# EAGLE design MS20v2 (EAGLE 9.6.2)
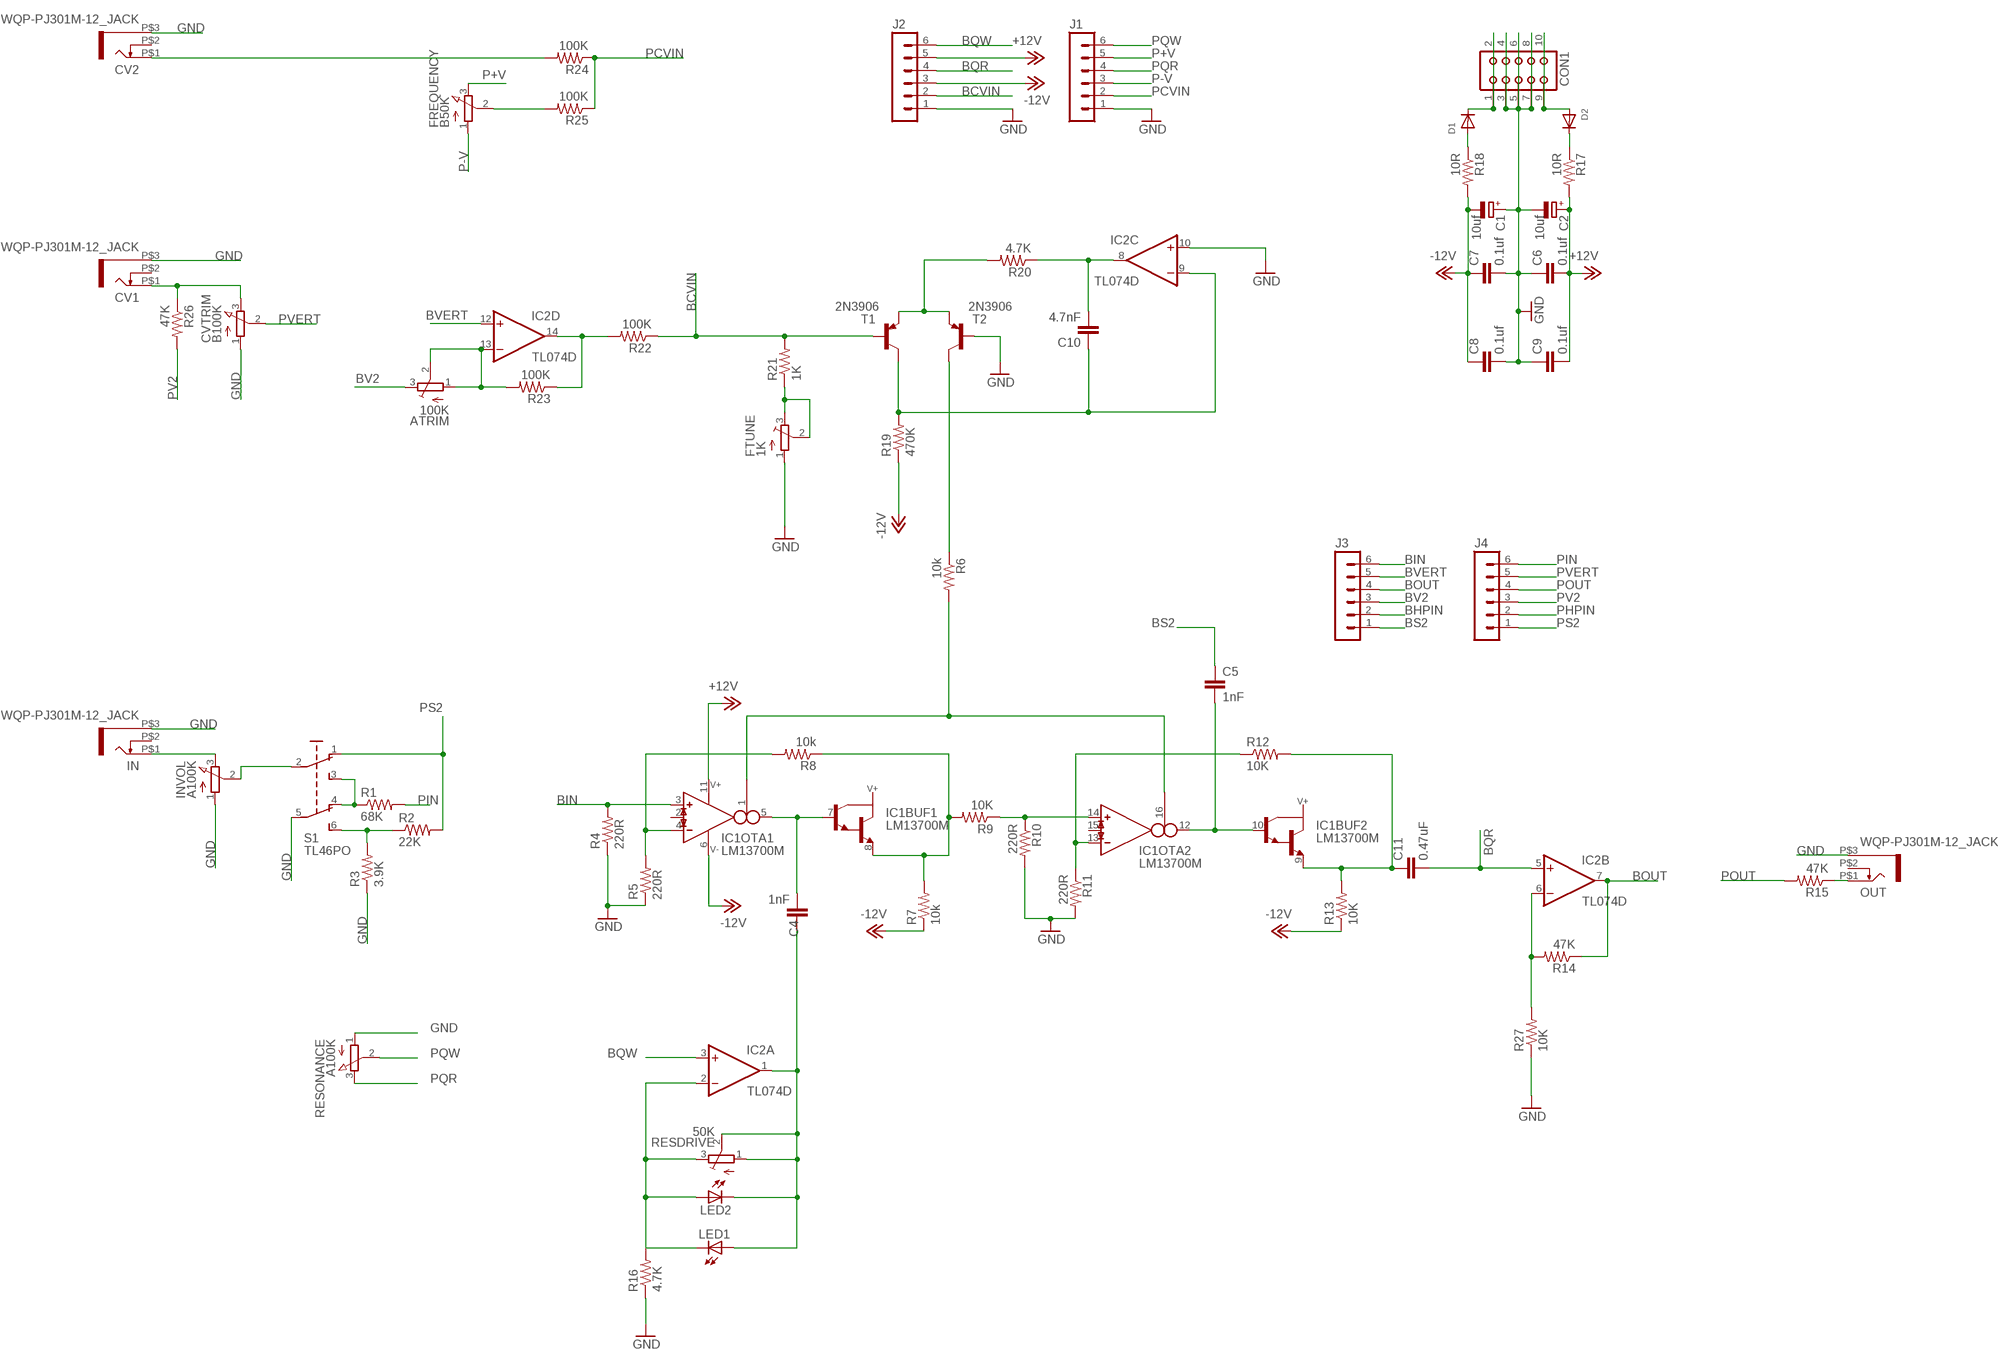
[diagram p0: schematic, sheet 1]

## Parts
ATRIM  100K  TRIMPOTTC33X  [TC33X]
C1  10uf  CPOL-EU153CLV-0405  [153CLV-0405]
C2  10uf  CPOL-EU153CLV-0405  [153CLV-0405]
C4  1nF  C-EUC0603  [C0603]
C5  1nF  C-EUC0603  [C0603]
C6  0.1uf  C-EUC0603  [C0603]
C7  0.1uf  C-EUC0603  [C0603]
C8  0.1uf  C-EUC0603  [C0603]
C9  0.1uf  C-EUC0603  [C0603]
C10  4.7nF  C-EUC0603  [C0603]
C11  0.47uF  C-EUC0603  [C0603]
CON1  CON10  [CON10]
CV1  WQP-PJ301M-12_JACK  [WQP-PJ301M-12_JACK]
CV2  WQP-PJ301M-12_JACK  [WQP-PJ301M-12_JACK]
CVTRIM  B100K  EVUF2A  [EVUF]
D1  DIODESOD-123  [SOD-123]
D2  DIODESOD-123  [SOD-123]
FREQUENCY  B50K  EVUF2A  [EVUF]
FTUNE  1K  TRIMPOTTC33X  [TC33X]
IC1  LM13700M  [SO16]
IC2  TL074D  [SO14]
IN  WQP-PJ301M-12_JACK  [WQP-PJ301M-12_JACK]
INVOL  A100K  EVUF2A  [EVUF]
J1  MA06-1  [MA06-1]
J2  MA06-1  [MA06-1]
J3  MA06-1  [MA06-1]
J4  MA06-1  [MA06-1]
LED1  LED3MM  [LED3MM]
LED2  LED3MM  [LED3MM]
OUT  WQP-PJ301M-12_JACK  [WQP-PJ301M-12_JACK]
R1  68K  R-US_R0603  [R0603]
R2  22K  R-US_R0603  [R0603]
R3  3.9K  R-US_R0603  [R0603]
R4  220R  R-US_R0603  [R0603]
R5  220R  R-US_R0603  [R0603]
R6  10k  R-US_R0603  [R0603]
R7  10k  R-US_R0603  [R0603]
R8  10k  R-US_R0603  [R0603]
R9  10K  R-US_R0603  [R0603]
R10  220R  R-US_R0603  [R0603]
R11  220R  R-US_R0603  [R0603]
R12  10K  R-US_R0603  [R0603]
R13  10K  R-US_R0603  [R0603]
R14  47K  R-US_R0603  [R0603]
R15  47K  R-US_R0603  [R0603]
R16  4.7K  R-US_R0603  [R0603]
R17  10R  R-US_R0603  [R0603]
R18  10R  R-US_R0603  [R0603]
R19  470K  R-US_R0603  [R0603]
R20  4.7K  R-US_R0603  [R0603]
R21  1K  R-US_R0603  [R0603]
R22  100K  R-US_R0603  [R0603]
R23  100K  R-US_R0603  [R0603]
R24  100K  R-US_R0603  [R0603]
R25  100K  R-US_R0603  [R0603]
R26  47K  R-US_R0603  [R0603]
R27  10K  R-US_R0603  [R0603]
RESDRIVE  50K  TRIMPOTTC33X  [TC33X]
RESONANCE  A100K  EVUF2A  [EVUF]
S1  TL46PO  [TL4XPO]
T1  2N3906  MMBT3906LT1-PNP-SOT23-BEC  [SOT23-BEC]
T2  2N3906  MMBT3906LT1-PNP-SOT23-BEC  [SOT23-BEC]

## Nets
+12V: C2.+ C6.2 C9.2 IC1.11(SUPPLY:V+) J2.5 R17.2
-12V: C1.- C7.1 C8.1 IC1.6(SUPPLY:V-) J2.3 R7.1 R13.1 R18.2 R19.1
BCVIN: J2.2 R21.2 R22.1 T1.B
BHPIN: J3.2
BIN: IC1.3(OTA1:IN_P) J3.6 R4.2
BOUT: IC2.7(B:OUT) J3.4 R14.1
BQR: C11.2 IC2.5(B:+IN) J2.4
BQW: IC2.3(A:+IN) J2.6
BS2: C5.1 J3.1
BV2: ATRIM.3(E) J3.3
BVERT: IC2.12(D:+IN) J3.5
GND: C1.+ C2.- C6.1 C7.2 C8.2 C9.1 CON1.3 CON1.4 CON1.5 CON1.6 CON1.7 CON1.8 CV1.P$3 CV2.P$3 CVTRIM.1(A) FTUNE.1(A) IC2.10(C:+IN) IN.P$3 INVOL.1(A) J1.1 J2.1 OUT.P$3 R3.1 R4.1 R5.1 R10.2 R11.2 R16.1 R27.1 RESONANCE.1(A) S1.5(P1) T2.B
N$1: CON1.9 CON1.10 D2.A
N$2: CON1.1 CON1.2 D1.C
N$3: R1.1 S1.3(S) S1.4(O1)
N$4: R2.1 R3.2 S1.6(S1)
N$5: D1.A R18.1
N$6: IC1.4(OTA1:IN_N) R5.2 R8.2
N$7: CV1.P$1 CVTRIM.3(E) R26.1
N$8: D2.C R17.1
N$9: IC1.13(OTA2:IN_N) R11.1 R12.1
N$10: IC1.8(BUF1:E) R7.2 R8.1 R9.2
N$11: C4.2 IC1.5(OTA1:OUT) IC1.7(BUF1:B)
N$12: IC1.1(OTA1:I_BIAS) IC1.16(OTA2:I_BIAS) R6.2
N$13: IC2.14(D:OUT) R22.2 R23.1
N$14: C4.1 IC2.1(A:OUT) LED1.A LED2.K(C) RESDRIVE.1(A) RESDRIVE.2(S)
N$15: IC1.14(OTA2:IN_P) R9.1 R10.1
N$16: C11.1 IC1.9(BUF2:E) R12.2 R13.2
N$17: C5.2 IC1.10(BUF2:B) IC1.12(OTA2:OUT)
N$18: IC2.6(B:-IN) R14.2 R27.2
N$19: R6.1 T2.C
N$20: R20.2 T1.E T2.E
N$21: C10.2 IC2.8(C:OUT) R20.1
N$22: C10.1 IC2.9(C:-IN) R19.2 T1.C
N$23: IC2.2(A:-IN) LED1.K(C) LED2.A R16.2 RESDRIVE.3(E)
N$26: FTUNE.2(S) FTUNE.3(E) R21.1
N$28: ATRIM.1(A) ATRIM.2(S) IC2.13(D:-IN) R23.2
N$29: CV2.P$1 R24.2
N$30: INVOL.2(S) S1.2(P)
N$31: IN.P$1 INVOL.3(E)
N$40: FREQUENCY.2(S) R25.2
N$45: OUT.P$1 R15.1
P+V: FREQUENCY.3(E) J1.5
P-V: FREQUENCY.1(A) J1.3
PCVIN: J1.2 R24.1 R25.1
PHPIN: J4.2
PIN: J4.6 R1.2
POUT: J4.4 R15.2
PQR: J1.4 RESONANCE.3(E)
PQW: J1.6 RESONANCE.2(S)
PS2: J4.1 R2.2 S1.1(O)
PV2: J4.3 R26.2
PVERT: CVTRIM.2(S) J4.5
Unconnected: CV1.P$2 CV2.P$2 IC1.2(OTA1:I_DIODE) IC1.15(OTA2:I_DIODE) IN.P$2 OUT.P$2

## Power pins joined to a net without a drawn wire
+12V: IC2.4(P:V+)
-12V: IC2.11(P:V-)

## Library data of the parts
ATRIM FTUNE RESDRIVE = adafruit:TRIMPOT: SMT trimmer potentiometer part number TC33X http://www.ladyada.net/library/eagle
C1 C2 = rcl:CPOL-EU: POLARIZED CAPACITOR, European symbol; SPICEPREFIX: C
C4-C11 = rcl:C-EU: CAPACITOR, European symbol; SPICEPREFIX: C
CON1 = con-harting:CON10: CONNECTOR; OC_FARNELL: unknown; OC_NEWARK: unknown
CV1 CV2 IN OUT = thonkiconn:WQP-PJ301M-12_JACK
CVTRIM FREQUENCY INVOL RESONANCE = pot:EVU: 9 mm Square Rotary Potentiometers Source: Panasonic
D1 D2 = adafruit:DIODE: Diode SMADIODE - SMA Surface Mount Package 20V 1A Schottky Diode Digikey: 641-1014-6-ND DO-1N4148 - Through Hole Small Current Diode SOD-123 20V 1 A (.5mV Vf) Schottky Diode - Digikey: MBRX120TPMSCT-ND SOD-323 10V 570mA (.38mV Vf, 3ns) Schottky Diode - Digikey: ZLLS410CT-ND SOD-523 30V 30mA Schottky Diode (RB751S-40TE61) - Digikey: RB751S-40TE61CT-ND SOT23-R/W - SOT23 Package (R = Solder Paste/Reflow Ovens, W = Hand-Soldering) BAT54Film 40V 300mA - Digikey: 497-7162-1-ND
IC1 = ota:LM13700: Dual OTA with buffers
IC2 = linear:TL074: OP AMP
J1-J4 = con-lstb:MA06-1: PIN HEADER; OC_FARNELL: unknown; OC_NEWARK: unknown
LED1 LED2 = adafruit:LED: LED OSRAM: - CHIPLED LG R971, LG N971, LY N971, LG Q971, LY Q971, LO R971, LY R971 LH N974, LH R974 LS Q976, LO Q976, LY Q976 LO Q996 - Hyper CHIPLED LW Q18S LB Q993, LB Q99A, LB R99A - SideLED LS A670, LO A670, LY A670, LG A670, LP A670 LB A673, LV A673, LT A673, LW A673 LH A674 LY A675 LS A676, LA A676, LO A676, LY A676, LW A676 LS A679, LY A679, LG A679 - Hyper Micro SIDELED® LS Y876, LA Y876, LO Y876, LY Y876 LT Y87S - SmartLED LW L88C, LW L88S LB L89C, LB L89S, LG L890 LS L89K, LO L89K, LY L89K LS L896, LA L896, LO L896, LY L896 - TOPLED LS T670, LO T670, LY T670, LG T670, LP T670 LSG T670, LSP T670, LSY T670, LOP T670, LYG T670 LG T671, LOG T671, LSG T671 LB T673, LV T673, LT T673, LW T673 LH T674 LS T676, LA T676, LO T676, LY T676, LB T676, LH T676, LSB T676, LW T676 LB T67C, LV T67C, LT T67C, LS T67K, LO T67K, LY T67K, LW E67C LS E67B, LA E67B, LO E67B, LY E67B, LB E67C, LV E67C, LT E67C LW T67C LS T679, LY T679, LG T679 LS T770, LO T770, LY T770, LG T770, LP T770 LB T773, LV T773, LT T773, LW T773 LH T774 LS E675, LA E675, LY E675, LS T675 LS T776, LA T776, LO T776, LY T776, LB T776 LHGB T686 LT T68C, LB T68C - Hyper Mini TOPLED® LB M676 - Mini TOPLED Santana® LG M470 LS M47K, LO M47K, LY M47K Source: http://www.osram.convergy.de/
R1-R27 = rcl:R-US_: RESISTOR, American symbol; SPICEPREFIX: R
S1 = switch:TL46PO: TINY SWITCH ON - ON Source: http://www2.produktinfo.conrad.com/datenblaetter/700000-724999/705152-da-01-de-Subminiaturschalter_TL_36YO.pdf
T1 T2 = transistor:*-PNP-: PNP Transistror

## Board
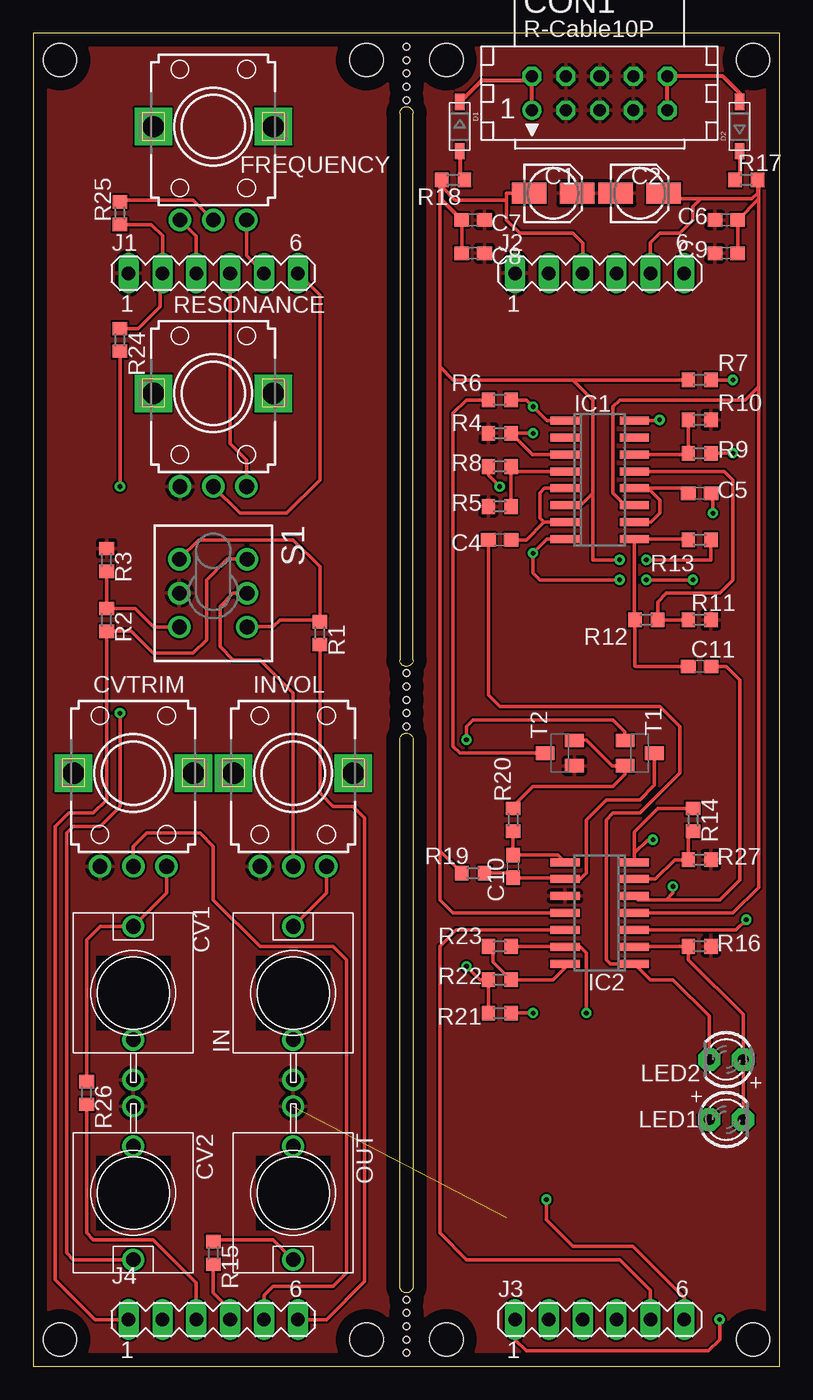
[diagram p1: board, top side]
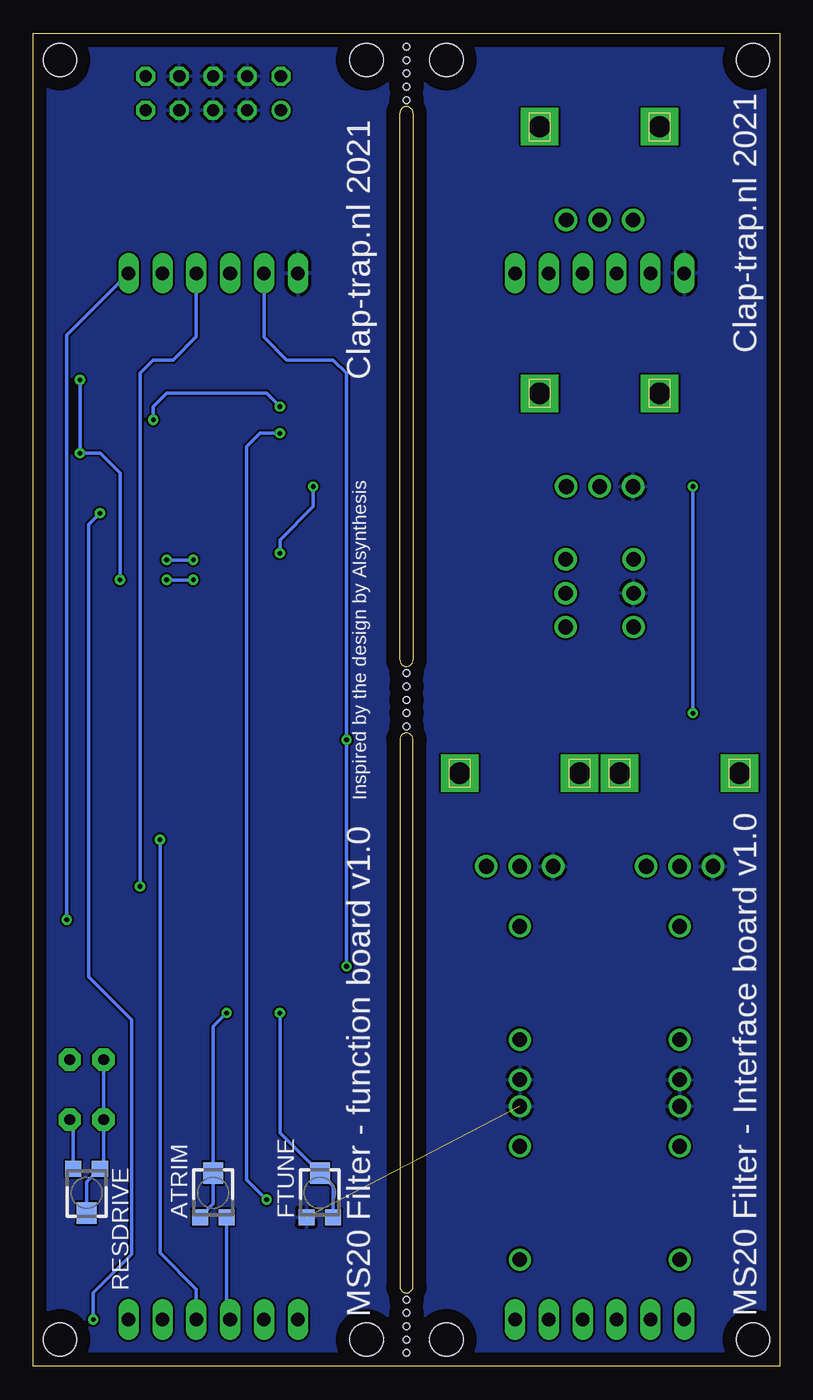
[diagram p2: board, bottom side, seen from below]

Size 56 x 100 mm. Coordinates in mm from the lower left corner, seen from the top.
Outline: 0,0 56,0 56,100 0,100 0,0
Outline: 28.5,53 arc-180 27.5,53 27.5,94 arc-180 28.5,94 28.5,53
Outline: 27.5,47 arc-180 28.5,47 28.5,6 arc-180 27.5,6 27.5,47
Copper layers (1*16): Top 0.035mm / dielectric 1.5mm / Bottom 0.035mm
Design rules "default": minimum track width 6mil, minimum drill 0.35mm, track to track 6mil, track to pad 6mil, pad to pad 6mil, via to via 6mil, smd to smd 6mil, copper to edge 40mil, drill to drill 6mil, minimum pad ring 10mil, minimum via ring 8mil, stop-mask expansion 4mil, vias tented up to drill 0mil, thermal gap 10mil
Holes 2.5 mm at 2,2 25,2 31,2 54,2 2,98 25,98 31,98 54,98
Holes 0.5 mm at 28,4 28,3 28,2 28,1 28,5 28,99 28,98 28,97 28,96 28,95 28,51 28,50 28,49 28,48 28,52

### Footprints (pad centres in the part's own frame; a part is rotated, then mirrored left to right if it is on the bottom)
TC33X = smd 1.2 x 1.2: 1 -1,-1.825; 3 1,-1.825 | smd 1.5 x 1.6: 2 0,1.5
153CLV-0405 = smd 2.6 x 1.6: + 1.8,0; - -1.8,0
C0603 = smd 1.1 x 1: 1 -0.85,0; 2 0.85,0
CON10 = drill 0.914: 1 -5.08,-1.27 | drill 0.914 octagon: 2 -5.08,1.27; 3 -2.54,-1.27; 4 -2.54,1.27; 5 0,-1.27; 6 0,1.27; 7 2.54,-1.27; 8 2.54,1.27; 9 5.08,-1.27; 10 5.08,1.27
WQP-PJ301M-12_JACK = drill 1.1: P$1 0,5; P$2 0,-3.5; P$3 0,-6.5
EVUF = drill 1.1 pad 1.676: 1 -2.5,-7; 2 0,-7; 3 2.5,-7 | drill 1.6 pad 2.8 square: M1 4.5,0; M2 -4.5,0
SOD-123 = smd 1.2 x 0.7: A 1.85,0; C -1.85,0
SO16 = smd 0.6 x 2.2: 1 -4.445,-2.6; 2 -3.175,-2.6; 3 -1.905,-2.6; 4 -0.635,-2.6; 5 0.635,-2.6; 6 1.905,-2.6; 7 3.175,-2.6; 8 4.445,-2.6; 9 4.445,2.6; 10 3.175,2.6; 11 1.905,2.6; 12 0.635,2.6; 13 -0.635,2.6; 14 -1.905,2.6; 15 -3.175,2.6; 16 -4.445,2.6
SO14 = smd 0.6 x 2.2: 1 -3.81,-2.6; 2 -2.54,-2.6; 3 -1.27,-2.6; 4 0,-2.6; 5 1.27,-2.6; 6 2.54,-2.6; 7 3.81,-2.6; 8 3.81,2.6; 9 2.54,2.6; 10 1.27,2.6; 11 0,2.6; 12 -1.27,2.6; 13 -2.54,2.6; 14 -3.81,2.6
MA06-1 = drill 1.016 long: 1 -6.35,0; 2 -3.81,0; 3 -1.27,0; 4 1.27,0; 5 3.81,0; 6 6.35,0
LED3MM = drill 0.813 pad 1.676 octagon: A -1.27,0; K 1.27,0
R0603 = smd 1 x 1.1: 1 -0.85,0; 2 0.85,0
TL4XPO = drill 1.1 pad 1.676: 1 -2.54,2.54; 2 0,2.54; 3 2.54,2.54; 4 -2.54,-2.54; 5 0,-2.54; 6 2.54,-2.54
SOT23-BEC = smd 1 x 1.4: B -0.95,-1.1; C 0,1.1; E 0.95,-1.1

### Placement (x,y rotation side)
ATRIM  42.5,13 0 bottom
C1  39,88 0 top
C2  45.5,88 0 top
C4  35,62 0 top
C5  50,65.5 180 top
C6  52,86 0 top
C7  33,86 0 top
C8  33,83.5 0 top
C9  52,83.5 0 top
C10  36,37.5 90 top
C11  50,52.5 0 top
CON1  42.5,95.5 0 top
CV1  7.5,28 0 top
CV2  7.5,13 180 top
CVTRIM  7.5,44.5 0 top
D1  32,93 270 top
D2  53,93 90 top
FREQUENCY  13.5,93 0 top
FTUNE  34.5,13 0 bottom
IC1  42.5,66.5 270 top
IC2  42.5,34 90 top
IN  19.5,28 0 top
INVOL  19.5,44.5 0 top
J1  13.5,82 0 top
J2  42.5,82 0 top
J3  42.5,3.5 0 top
J4  13.5,3.5 0 top
LED1  52,18.5 0 top
LED2  52,23 180 top
OUT  19.5,13 180 top
R1  21.5,55 270 top
R2  5.5,56 270 top
R3  5.5,60.5 270 top
R4  35,70 0 top
R5  35,64.5 0 top
R6  35,72.5 0 top
R7  50,74 0 top
R8  35,67.5 0 top
R9  50,68.5 0 top
R10  50,71 0 top
R11  50,56 0 top
R12  46,56 180 top
R13  50,62 180 top
R14  49.5,41 270 top
R15  13.5,8.5 270 top
R16  50,31.5 180 top
R17  53.5,89 0 top
R18  31.5,89 180 top
R19  33,37 0 top
R20  36,41 90 top
R21  35,26.5 180 top
R22  35,29 0 top
R23  35,31.5 0 top
R24  6.5,77 270 top
R25  6.5,86.5 90 top
R26  4,20.5 270 top
R27  50,38 180 top
RESDRIVE  52,13 180 bottom
RESONANCE  13.5,73 0 top
S1  13.5,58 270 top
T1  45.5,46 270 top
T2  39.5,46 90 top

### Tracks (layer width: path | path; a pad name or v marks a point on that pad's centre or on a via)
+12V
  Top 0.254: C9.2 C6.2 54.42,87.58 | IC1.11 45.2,64.5 44.5,64.5 43.5,65.5 43.5,72 44,72.5 53.42,72.5 54.42,73.5 | 54.42,87.58 54.42,73.5 | 54.42,87.58 54.42,88.78 R17.2 54.35,88 53.92,87.58 50.08,87.58 | 54.42,73.5 54.42,35.92 52.5,34 IC2.4 | 50.08,87.58 49.5,87 49.5,86 48.5,85 47,85 46.31,84.31 J2.5 | C2.+ 47.73,87.58 50.08,87.58
-12V  (via drill 0.35)
  Top 0.254: C7.1 C8.1 | 35.5,87.5 31.65,87.5 30.65,88.5 R18.2 30.5,88.85 30.5,75 | C1.- 35.5,88 35.5,87.5 | 35.5,87.5 35.5,86 36.5,85 40.5,85 41.23,84.27 J2.3 | 30.5,75 30.5,38.65 30.57,38.58 | R7.1 40.5,74 | 40.5,74 31.5,74 30.5,75 | 40.5,74 42,72.5 42,65.5 | 42,65.5 41.09,64.59 IC1.6 | R19.1 30.57,38.58 | 30.57,38.58 30.5,38.5 30.5,35 31.5,34 IC2.11 | R13.1 50.85,60.5 v46,60.5 | 42,65.5 42,60.5 v44,60.5
  Top 0.305: C7.1 30.65,87.5 R18.2
  Bottom 0.254: v46,60.5 v44,60.5
BCVIN  (via drill 0.35)
  Top 0.254: R21.2 R22.1 33.5,29 v32.5,30 | T1.B 44.4,47.6 43.5,48.5 33,48.5 32.5,48 v32.5,47
  Bottom 0.254: v32.5,30 v32.5,47 32.5,74.5 33.5,75.5 37,75.5 38.69,77.19 J2.2
BIN  (via drill 0.35)
  Top 0.254: IC1.3 37.45,68.41 R4.2 v37.5,70 | J3.6 48.85,5.15 45,9 40.5,9 38.5,11 v38.5,12.5
  Bottom 0.254: v38.5,12.5 40,14 40,69 39,70 v37.5,70
BOUT  (via drill 0.35)
  Top 0.254: R14.1 46.85,41.85 45.1,40.1 IC2.7 45.1,38.5 46.1,39.5 v46.5,39.5
  Bottom 0.254: v46.5,39.5 46.5,8.5 43.77,5.77 J3.4
BQR  (via drill 0.35)
  Top 0.254: 47.5,35 45.37,35 IC2.5 | v48,36 48,35.5 47.5,35 | 47.5,35 51.5,35 53,36.5 53,51.5 52,52.5 C11.2
  Bottom 0.254: v48,36 48,74.5 47,75.5 45.5,75.5 43.77,77.23 J2.4
BQW  (via drill 0.35)
  Top 0.254: IC2.3 52.73,32.73 v53.5,33.5
  Bottom 0.254: J2.6 53.5,77.35 v53.5,33.5
BS2  (via drill 0.35)
  Top 0.254: C5.1 51,65.35 v51,64 | J3.1 36.15,1.99 37,1.14 50.64,1.14 51.5,2 v51.5,3.5
  Bottom 0.254: v51,64 51.85,63.15 51.85,29.2 48.61,25.96 48.61,8.39 51.5,5.5 v51.5,3.5
BV2
  Bottom 0.254: ATRIM.3 41.5,3.77 J3.3
BVERT
  Top 0.254: IC2.12 31.73,32.73 30.5,31.5 30.5,10 32.5,8 44,8 46.31,5.69 J3.5
GND  (1 unrouted)
  pour Top: 0,100 56,100 56,0 0,0
  pour Bottom: 0,100 56,100 56,0 0,0
N$1
  Top 0.254: CON1.9 47.77,94.23 48.15,93.85
  Top 0.305: CON1.9 CON1.10 51.73,96.77 53,95.5 D2.A
N$2
  Top 0.254: CON1.1 37.04,93.85 | 37.42,96.5 CON1.2
  Top 0.305: CON1.1 37.42,96.5 33.65,96.5 D1.C
N$3
  Top 0.254: 21.5,56 21.5,60 19.5,62 12.42,62 S1.4 | 21.5,56 R1.1 | S1.3 16.08,55.5 18,55.5 18.5,56 21.5,56
N$4
  Top 0.254: R3.2 R2.1 7.65,56.85 9.04,55.46 S1.6
N$5
  Top 0.254: 32,89.35 R18.1
  Top 0.305: D1.A 32,89.35
N$6
  Top 0.254: R5.2 R8.2 36.22,67.14 IC1.4
N$7
  Top 0.254: R26.1 4,32 5,33 CV1.P$1 10,35.5 CVTRIM.3
N$8
  Top 0.254: 53,89.35 R17.1
  Top 0.305: D2.C 53,89.35
N$9
  Top 0.254: R11.1 R12.1 46.85,57.35 47.5,58 51.5,58 52.5,59 52.5,66.5 51.87,67.14 IC1.13
N$10  (via drill 0.35)
  Top 0.254: R8.1 34.15,66.85 v35,66 | IC1.8 38.55,62.05 v37.5,61 37.5,59.5 38,59 v44,59 | v46,59 v49.5,59 | R9.2 v52.5,68.5 | R7.2 v52.5,74
  Bottom 0.254: v37.5,61 37.5,62 35,64.5 v35,66 | v44,59 v46,59 | v49.5,59 49.5,67 51,68.5 v52.5,68.5 v52.5,74
N$11
  Top 0.254: IC1.7 38.33,63.33 | 38.33,63.33 37,62 C4.2 | IC1.5 38.37,65.86 38,65.5 38,63.65 38.33,63.33
N$12  (via drill 0.35)
  Top 0.254: 40.4,70.94 IC1.1 38.55,70.94 v37.5,72 37,72.5 R6.2 | v47,71 46.95,70.94 IC1.16
  Bottom 0.254: v37.5,72 38.5,73 46,73 47,72 v47,71
N$13
  Top 0.254: IC2.14 39.9,29.9 39,29 R22.2 34.5,30.35 34.5,31.15 R23.1
N$14
  Top 0.254: LED2.K 50.73,26.27 48,29 46.29,29 IC2.1 43.31,30.19 43,30.5 43,41 43.5,41.5 45.5,41.5 48.5,44.5 48.5,48 47,49.5 35,49.5 34.15,50.35 C4.1
  Bottom 0.254: RESDRIVE.2 52,13.82 RESDRIVE.1 50.73,15.1 LED1.A LED2.K
N$15
  Top 0.254: R10.1 R9.1 49.05,68.41 IC1.14
N$16
  Top 0.254: R13.2 49.09,62.05 IC1.9 45.1,56.05 R12.2 45.15,52.55 45.2,52.5 C11.1
N$17
  Top 0.254: C5.2 48.78,65.86 IC1.12 46.13,65.86 47,65 47,64 46.33,63.33 IC1.10
N$18
  Top 0.254: IC2.6 46.69,36.54 48.15,38 R27.2 49.15,39.8 R14.2
N$19
  Top 0.254: T2.C 32,46 31.5,46.5 31.5,71.5 32.5,72.5 R6.1
N$20
  Top 0.254: T2.E 40.65,47 41.5,47 43.45,45.05 T1.E 44.4,44.4 43.5,43.5 37.5,43.5 36,42 R20.2
N$21
  Top 0.254: IC2.8 39.36,38.35 C10.2 R20.1
N$22
  Top 0.254: R19.2 35.65,37 C10.1 39.79,36.65 IC2.9 41.04,36.54 41.5,37 41.5,41 43,42.5 45.5,42.5 46.6,43.6 T1.C
N$23
  Top 0.254: IC2.2 45.14,31.5 R16.2 49.15,30.5 53.27,26.38 LED2.A LED1.K
  Bottom 0.254: RESDRIVE.3 53,18.23 LED1.K
N$26  (via drill 0.35)
  Top 0.254: R21.1 v37.5,26.5
  Bottom 0.254: FTUNE.3 33.5,13.5 FTUNE.2 37.5,17.5 v37.5,26.5
N$28  (via drill 0.35)
  Top 0.254: R23.2 39.86,31.5 IC2.13 41.04,31.46 41.5,31 v41.5,26.5
  Bottom 0.254: ATRIM.1 42.5,12.18 ATRIM.2 42.5,25.5 v41.5,26.5
N$29  (via drill 0.35)
  Top 0.254: CV2.P$1 3,8 2.5,8.5 2.5,40 3,40.5 5,40.5 6.5,42 v6.5,49 | v6.5,66 R24.2
  Bottom 0.254: v6.5,49 v6.5,66
N$30
  Top 0.254: INVOL.2 19.5,50.5 17,53 15,53 14,54 14,57 15,58 S1.2
N$31
  Top 0.254: IN.P$1 22,35.5 INVOL.3
N$40
  Top 0.254: FREQUENCY.2 12,87.5 6.65,87.5 R25.2
N$45
  Top 0.254: R15.1 13.65,9.5 18,9.5 OUT.P$1
P+V
  Top 0.254: J1.5 16,83.31 FREQUENCY.3
P-V
  Top 0.254: FREQUENCY.1 12.23,84.77 J1.3
PCVIN
  Top 0.254: R25.1 8.85,85.65 9.69,84.81 J1.2 9.5,81.81 9.5,79.5 7.85,77.85 R24.1
PIN
  Top 0.254: J4.6 22,3.5 24.86,6.36 24.86,41.14 24,42 22.5,42 21.5,43 R1.2
POUT
  Top 0.254: J4.4 14.77,4.23 13.5,5.5 R15.2
PQR
  Top 0.254: J1.4 14.77,69.23 16,68 RESONANCE.3
PQW
  Top 0.254: RESONANCE.2 15.5,64 19,64 21.5,66.5 21.5,80.35 J1.6
PS2
  Top 0.254: J4.1 4.64,3.5 1.64,6.5 1.64,40.5 2.64,41.5 4.5,41.5 5.5,42.5 R2.2 7.35,55.15 9,53.5 12,53.5 13,54.5 13,59 14.54,60.54 S1.1
PV2
  Top 0.254: R26.2 4,10 4.5,9.5 9,9.5 12.23,6.27 J4.3
PVERT
  Top 0.254: J4.5 17.31,5.31 18,6 22.5,6 23.5,7 23.5,30.5 22.5,31.5 17,31.5 13.5,35 13.5,39 12.5,40 8.5,40 7.5,39 CVTRIM.2

### Text on the board
bNames: Clap-trap.nl 2021 | Clap-trap.nl 2021 | MS20 Filter - Interface board v1.0 | Inspired by the design by AIsynthesis | MS20 Filter - function board v1.0